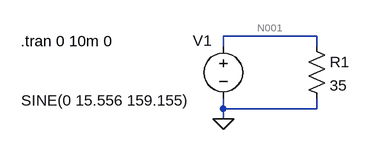
[diagram p0: schematic 1_1.asc]
1_1.asc, the LTspice schematic file:
Version 4.1
SHEET 1 880 680
WIRE 320 64 176 64
WIRE 176 80 176 64
WIRE 320 80 320 64
WIRE 176 176 176 160
WIRE 320 176 320 160
WIRE 320 176 176 176
WIRE 176 192 176 176
FLAG 176 192 0
SYMBOL voltage 176 64 R0
WINDOW 123 0 0 Left 0
WINDOW 39 24 124 Left 2
WINDOW 0 -47 7 Left 2
WINDOW 3 -311 99 Left 2
SYMATTR InstName V1
SYMATTR Value SINE(0 15.556 159.155)
SYMBOL res 304 64 R0
SYMATTR InstName R1
SYMATTR Value 35
TEXT -136 72 Left 2 !.tran 0 10m 0

The netlist it stands for:
* 1_1.asc
V1 N001 0 SINE(0 15.556 159.155)
R1 N001 0 35
.tran 0 10m 0
.backanno
.end

* Results of the author's LTspice run, read from the files saved beside the schematic
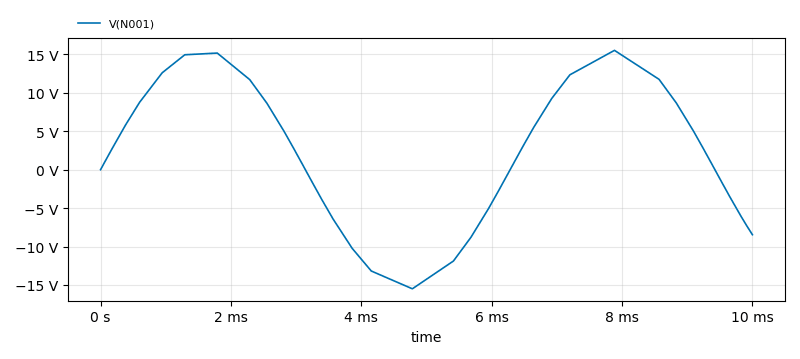
[diagram p1: Transient Analysis of 1_1.asc, plotted from the saved traces]
* Transient Analysis, 1 run:
*   V(N001): min -15.5 V, max 15.53 V, average 2.803 V, rms 10.56 V, last -8.463 V